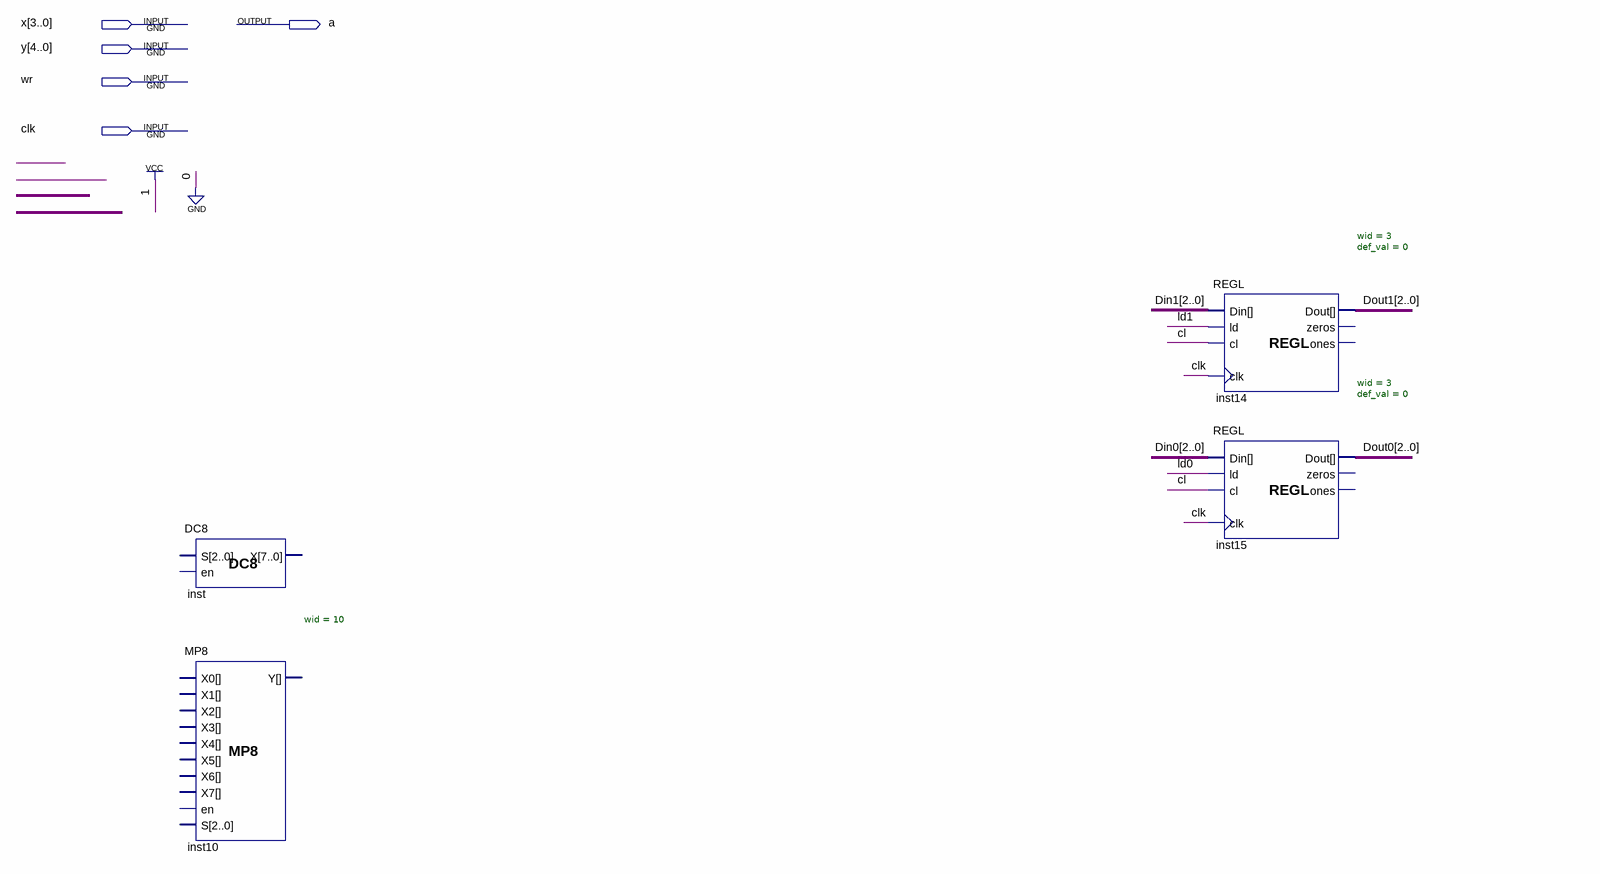
[diagram p0: schematic sheet]
// Quartus schematic mem4x4.bdf as structural Verilog: 4 symbols, 5 pins
module mem4x4 (
  input  [3:0] x,
  input  [4:0] y,
  input  wr,
  input  clk,
  output a
);

  wire cl, ld0, ld1;
  wire [2:0] Din0, Din1, Dout0, Dout1;

  DC8 inst ();  // open: S, en, X
  MP8 #(.wid(10)) inst10 ();  // open: X0, X1, X2, X3, X4, X5, X6, X7, en, S, Y
  REGL #(.wid(3), .def_val(0)) inst14 (.Din(Din1), .ld(ld1), .cl(cl), .clk(clk), .Dout(Dout1));  // open: zeros, ones
  REGL #(.wid(3), .def_val(0)) inst15 (.Din(Din0), .ld(ld0), .cl(cl), .clk(clk), .Dout(Dout0));  // open: zeros, ones
endmodule
